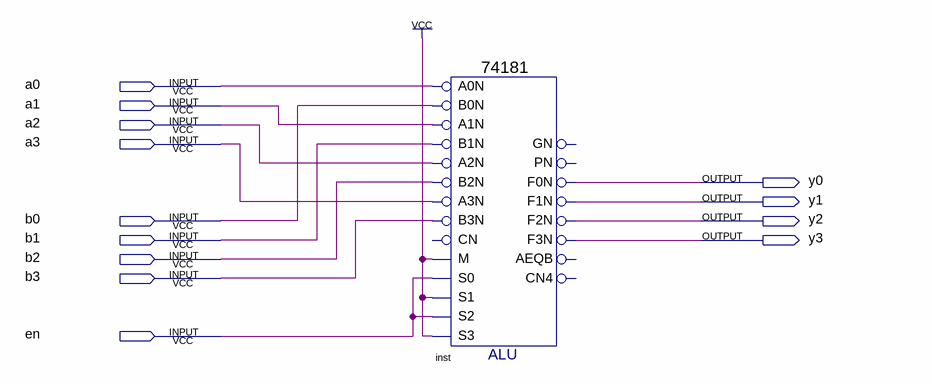
[diagram p0: schematic sheet]
// Quartus schematic data_replacer_4bits.bdf as structural Verilog: 1 symbols, 13 pins
module data_replacer_4bits (
  input  a0,
  input  a1,
  input  a2,
  input  a3,
  input  b0,
  input  b1,
  input  b2,
  input  b3,
  input  en,
  output y0,
  output y1,
  output y2,
  output y3
);

  \74181  inst (
    .B0N(b0), .A0N(a0), .A1N(a1), .B1N(b1), .A3N(a3), .B2N(b2), .A2N(a2), .M(1'b1), .B3N(b3), .S2(en),
    .S1(1'b1), .S0(en), .S3(1'b1), .F3N(y3), .F1N(y1), .F0N(y0), .F2N(y2));  // open: CN, PN, GN, AEQB, CN4
endmodule
